# EasyEDA schematic power_meter.json
TITLE: Sheet_1; REV: 1.0; Date: 2021-11-22; Sheet: 1/1; Company: Your Company
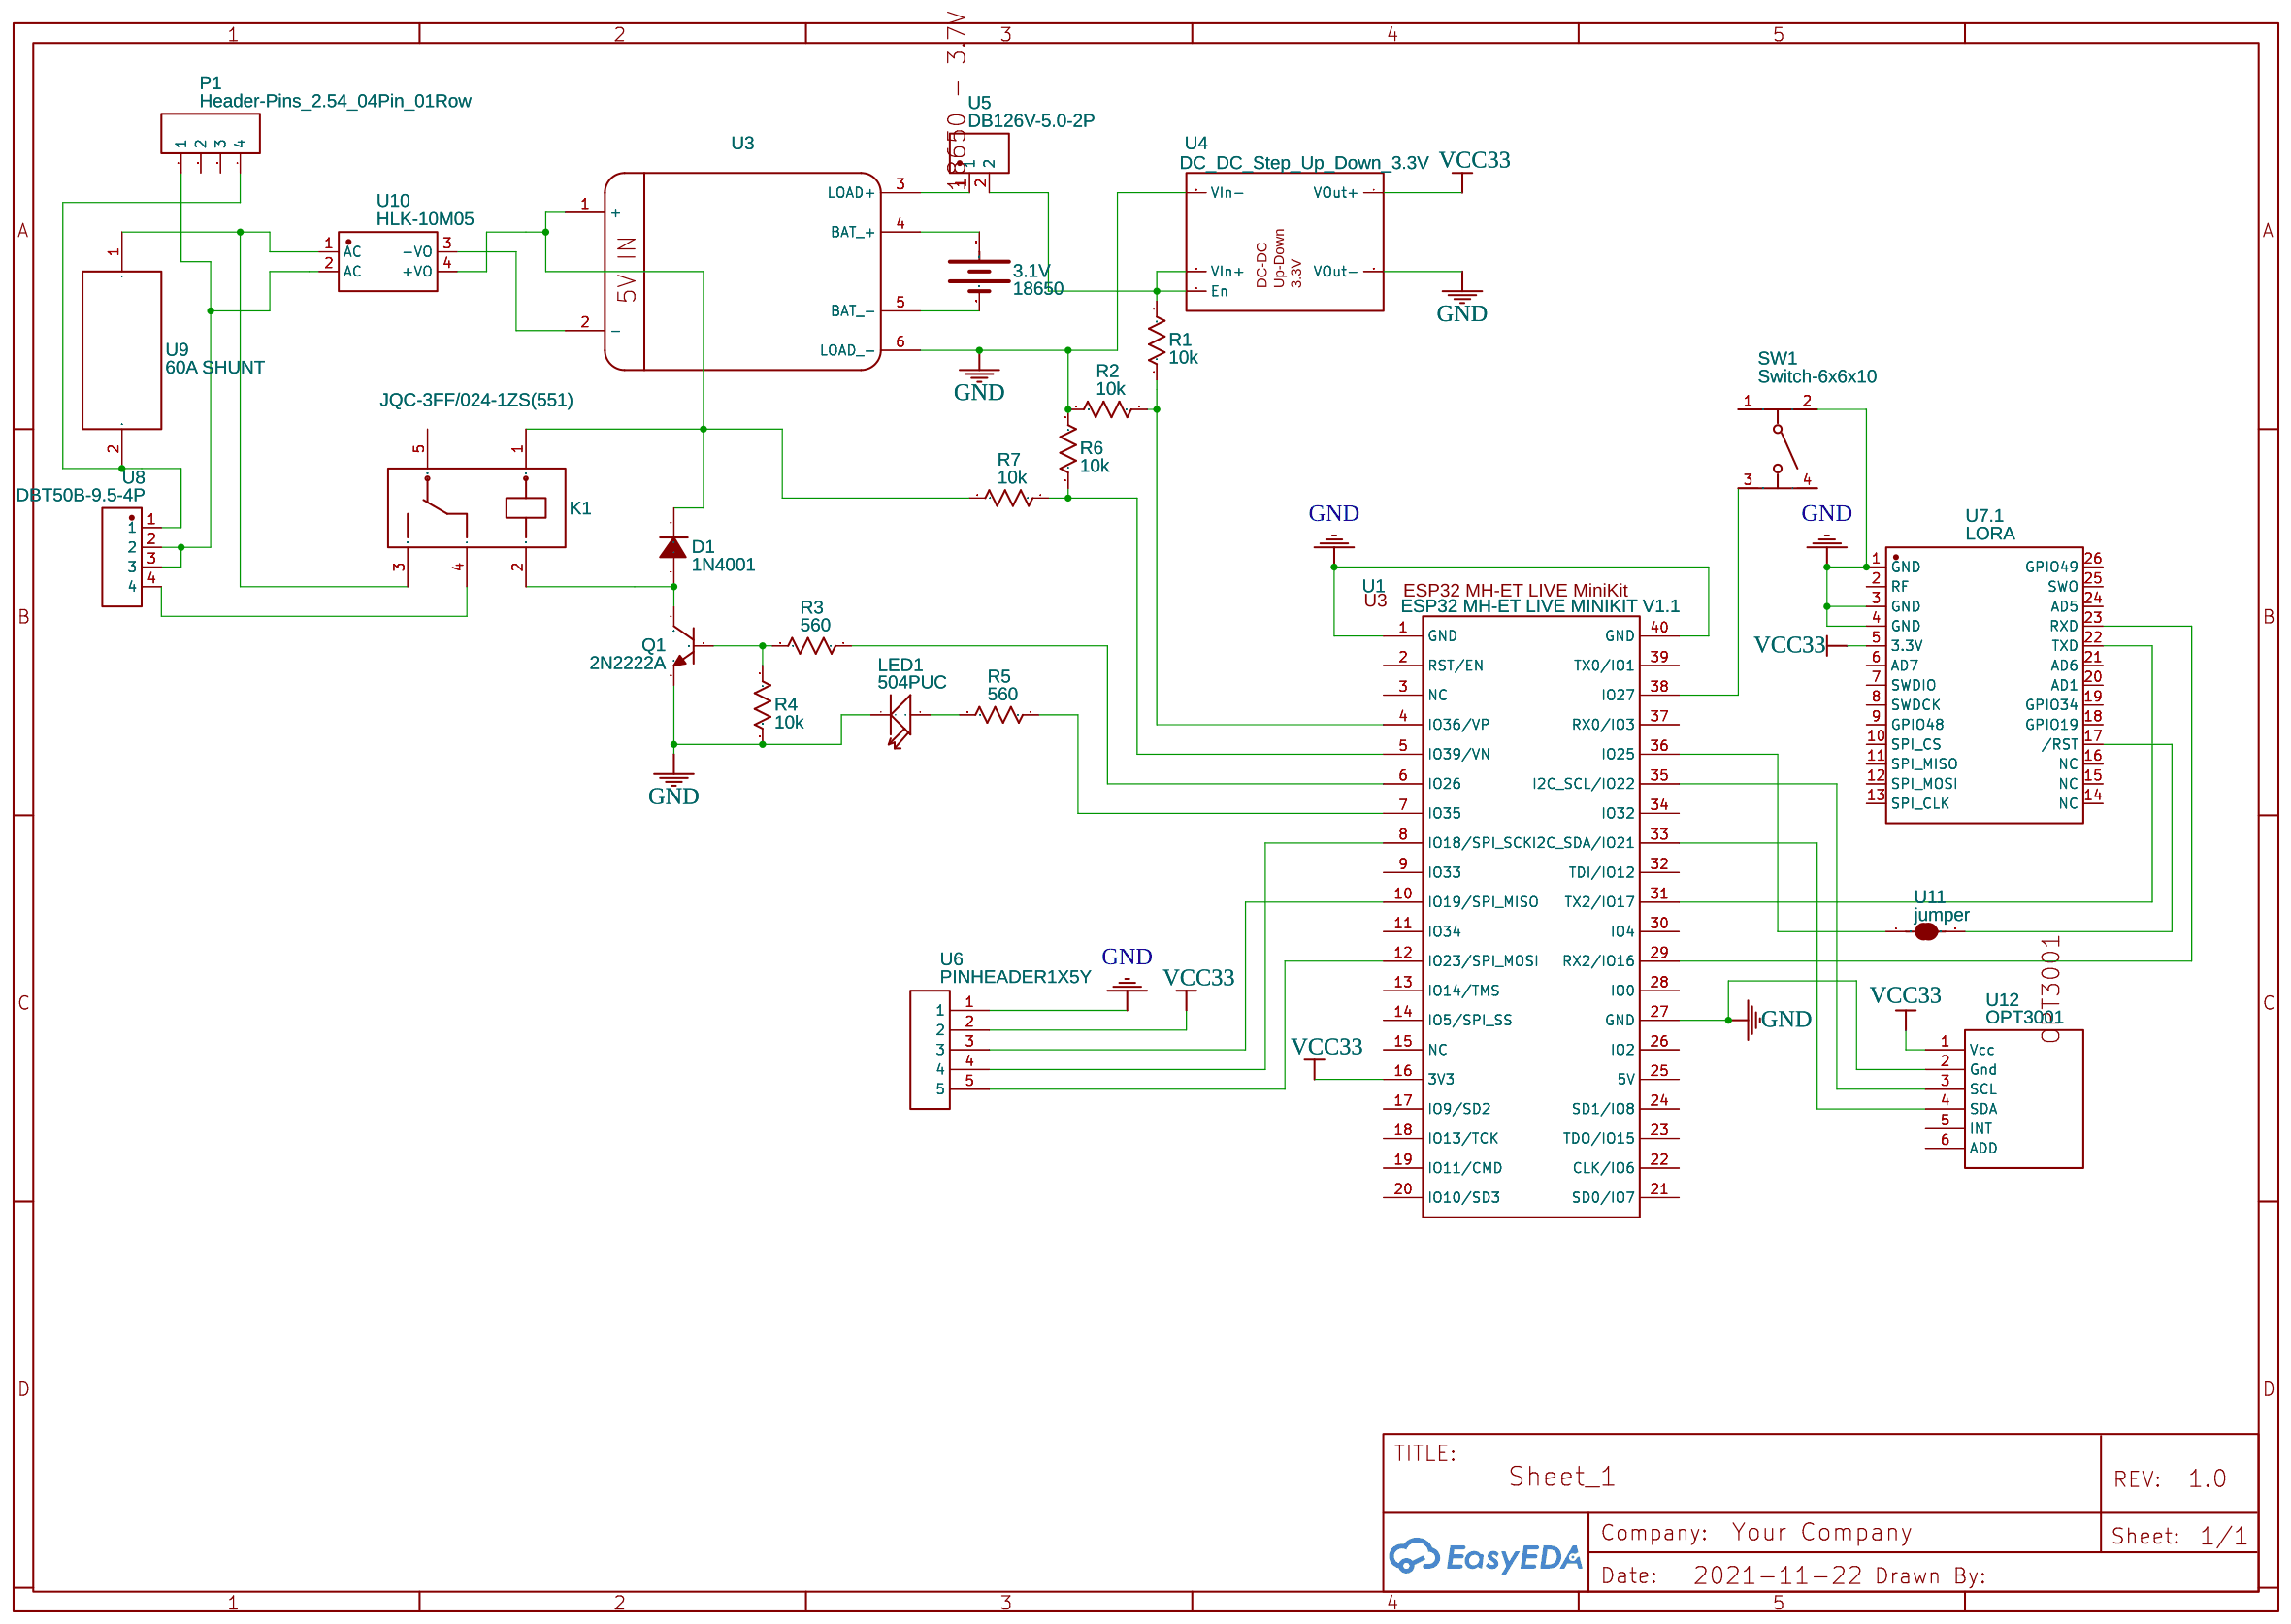
[diagram p0: schematic sheet]

## Parts
3.1V  18650  [18650-HOLDER]
D1  1N4001  [DO-41_BD2.4-L4.7-P8.70-D0.9-RD]
K1  JQC-3FF/024-1ZS(551)  [RELAY-TH_HF3FF-XX-1ZXX-XXX]
LED1  504PUC  [LED2-2.54-D5.0MM]
P1  Header-Pins_2.54_04Pin_01Row  [HEADER-PINS_2.54_04PIN_01ROW]
Q1  2N2222A  [TO-92-3_L4.8-W3.7-P2.54-R]
R1  10k  [PKG-0.25W RESISTOR]
R2  10k  [PKG-0.25W RESISTOR]
R3  560  [PKG-0.25W RESISTOR]
R4  10k  [PKG-0.25W RESISTOR]
R5  560  [PKG-0.25W RESISTOR]
R6  10k  [PKG-0.25W RESISTOR]
R7  10k  [PKG-0.25W RESISTOR]
SW1  Switch-6x6x10  [SW-TH_4P-L6.0-W6.0-P4.50-LS6.5]
U1  ESP32 MH-ET LIVE MINIKIT V1.1  [ESP32 MH-ET LIVE MINIKIT]
U3  TP4056 Type C Lithium Battery Charger Board  [TP4056 USBC_CHARGER_BOARD_FOOTPRINT]
U4  DC_DC_Step_Up_Down_3.3V  [DC_DC_STEP_UP_DOWN_3.3V]
U5  DB126V-5.0-2P  [CONN-TH_2P-P5.00_L7.8-W10.0]
U6  PINHEADER1X5Y  [PINHEADER1X5N]
U7  LORA  [MAXIIOT DL7612-AS923-TH]  (section 1)
U8  DBT50B-9.5-4P  [CONN-TH_DBT50B-9.5-4P]
U9  60A SHUNT  [60A SHUNT]
U10  HLK-10M05  [PWRM-TH_HLK-10M05]
U11  jumper  [JUMPER]
U12  OPT3001  [OPT3001]

## Library data of the parts
3.1V = 18650: Battery Holder; Contributor: Pauloscarello
D1 = 1N4001: Supplier: LCSC; Manufacturer: LRC; Supplier Part: C82804
K1 = JQC-3FF/024-1ZS(551): Supplier: LCSC; Manufacturer: HF; Supplier Part: C22709; JLCPCB Part Class: Extended Part
LED1 = 504PUC: DIP LED Transparent-Purple-5mm;
P1 = Header-Pins_2.54_04Pin_01Row: Contributor: FTI-Pilatus-Aircraft
Q1 = 2N2222A: Supplier: LCSC; Supplier Part: C358533; Manufacturer: Foshan Blue Rocket Elec; Contributor: LCSC; JLCPCB Part Class: Extended Part
R1-R7 = 10k: Power: 1/4W; Tolerance: ±5%; Supplier Part: 9339116; Supplier: Element14; Manufacturer: MULTICOMP; Manufacturer Part: MCF 0.25W 10K; Link: http://www.farnell.com/datasheets/1716725.pdf?_ga=2.130313612.2023696496.1506695686-238689616.1505921947&_gac=1.45287312.1506011718.EAIaIQobChMI57GX6tq21gIVTzobCh2WXgT2EAAYASAAEgKn9_D_BwE; Contributor: Prof. Ing. F. Scordino
SW1 = Switch-6x6x10: Supplier Part: C71840; Supplier: LCSC; Manufacturer: BBJ; Manufacturer Part: Switch,6*6*10Plastic head,260G, 0.25mm,Straight line
U1 = ESP32 MH-ET LIVE MINIKIT V1.1: Contributor: Micbelli
U3 = TP4056 Type C Lithium Battery Charger Board: Contributor: sarge852
U4 = DC_DC_Step_Up_Down_3.3V: link: https://ru.aliexpress.com/item/DC-DC-Auto-Boost-Buck-Converter-Module-DC-2-5-15V-to-DC-3-3V-4/32963598972.html; Contributor: Volodymyr L.
U5 = DB126V-5.0-2P: Supplier: LCSC; Supplier Part: C395849; Manufacturer: DIBO; Contributor: LCSC; JLCPCB Part Class: Extended Part
U6 = PINHEADER1X5Y: Supplier Part: undefined; Contributor: tek09; PİN P: FSFS
U7 = LORA: Supplier: LCSC; Supplier Part: C529580; Manufacturer: Espressif Systems; Manufacturer Part: ESP32-WROOM-32U(16MB); Contributor: LCSC; subpart_no: 1
U8 = DBT50B-9.5-4P: Supplier: LCSC; Supplier Part: C729813; Manufacturer: DIBO; Contributor: LCSC; JLCPCB Part Class: Extended Part
U9 = 60A SHUNT: Contributor: Ugoson
U10 = HLK-10M05: Supplier: LCSC; Supplier Part: C403745; Manufacturer: HI-LINK; Contributor: LCSC; JLCPCB Part Class: Extended Part
U11 = jumper: Contributor: melvin.prost
U12 = OPT3001: Contributor: deltree

## Nets
GND: LED1.- Q1.3(E) R2.2 R4.2 R6.2 SW1.2 U1.1(GND) U1.27(GND) U1.40(GND) U3.6(LOAD -) U4.3(VIn-) U4.5(VOut-) U6.1 U7.1(GND) U7.3(GND) U7.4(GND) U12.2(Gnd)
VCC33: U1.16(3V3) U4.4(VOut+) U6.2 U7.5(3.3V) U12.1(Vcc)
Net-(3.1V-GND): 3.1V.GND U3.5(BAT -)
Net-(3.1V-Positive): 3.1V.Positive U3.4(BAT +)
Net-(D1-1): D1.1(K) K1.1 R7.2 U3.1(+) U10.4(+VO)
Net-(D1-2): D1.2(A) K1.2 Q1.1(C)
Net-(K1-3): K1.3 U9.1 U10.1(AC)
Net-(K1-4): K1.4 U8.4
Net-(LED1-+): LED1.+ R5.2
Net-(P1-1): P1.1 U8.2 U8.3 U10.2(AC)
Net-(P1-4): P1.4 U8.1 U9.2
Net-(Q1-2): Q1.2(B) R3.2 R4.1
Net-(R1-1): R1.1 R2.1 U1.4(IO36/VP)
Net-(R1-2): R1.2 U4.1(En) U4.2(VIn+) U5.2
Net-(R3-1): R3.1 U1.6(IO26)
Net-(R5-1): R5.1 U1.7(IO35)
Net-(R6-1): R6.1 R7.1 U1.5(IO39/VN)
Net-(SW1-3): SW1.3 U1.38(IO27)
Net-(U1-8): U1.8(IO18/SPI SCK) U6.4
Net-(U1-10): U1.10(IO19/SPI MISO) U6.3
Net-(U1-12): U1.12(IO23/SPI MOSI) U6.5
Net-(U1-29): U1.29(RX2/IO16) U7.23(RXD)
Net-(U1-31): U1.31(TX2/IO17) U7.22(TXD)
Net-(U1-33): U1.33(I2C SDA/IO21) U12.4(SDA)
Net-(U1-35): U1.35(I2C SCL/IO22) U12.3(SCL)
Net-(U1-36): U1.36(IO25) U11.1
Net-(U3-2): U3.2(-) U10.3(-VO)
Net-(U3-3): U3.3(LOAD+) U5.1
Net-(U7.1-17): U7.17(/RST) U11.2

Not connected (* = marked no-connect by the designer): K1 5; P1 2 3; SW1 1 4; U1 2(RST/EN) 3(NC) 9(IO33) 11(IO34) 13(IO14/TMS) 14(IO5/SPI SS) 15(NC) 17(IO9/SD2) 18(IO13/TCK) 19(IO11/CMD) 20(IO10/SD3) 21(SD0/IO7) 22(CLK/IO6) 23(TDO/IO15) 24(SD1/IO8) 25(5V) 26(IO2) 28(IO0) 30(IO4) 32(TDI/IO12) 34(IO32) 37(RX0/IO3) 39(TX0/IO1); U7 2(RF) 6(AD7) 7(SWDIO) 8(SWDCK) 9(GPIO48) 10(SPI_CS) 11(SPI_MISO) 12(SPI_MOSI) 13(SPI_CLK) 14(NC) 15(NC) 16(NC) 18(GPIO19) 19(GPIO34) 20(AD1) 21(AD6) 24(AD5) 25(SWO) 26(GPIO49); U12 5(INT) 6(ADD)
